# EAGLE design Throttle (EAGLE 7.2.0)
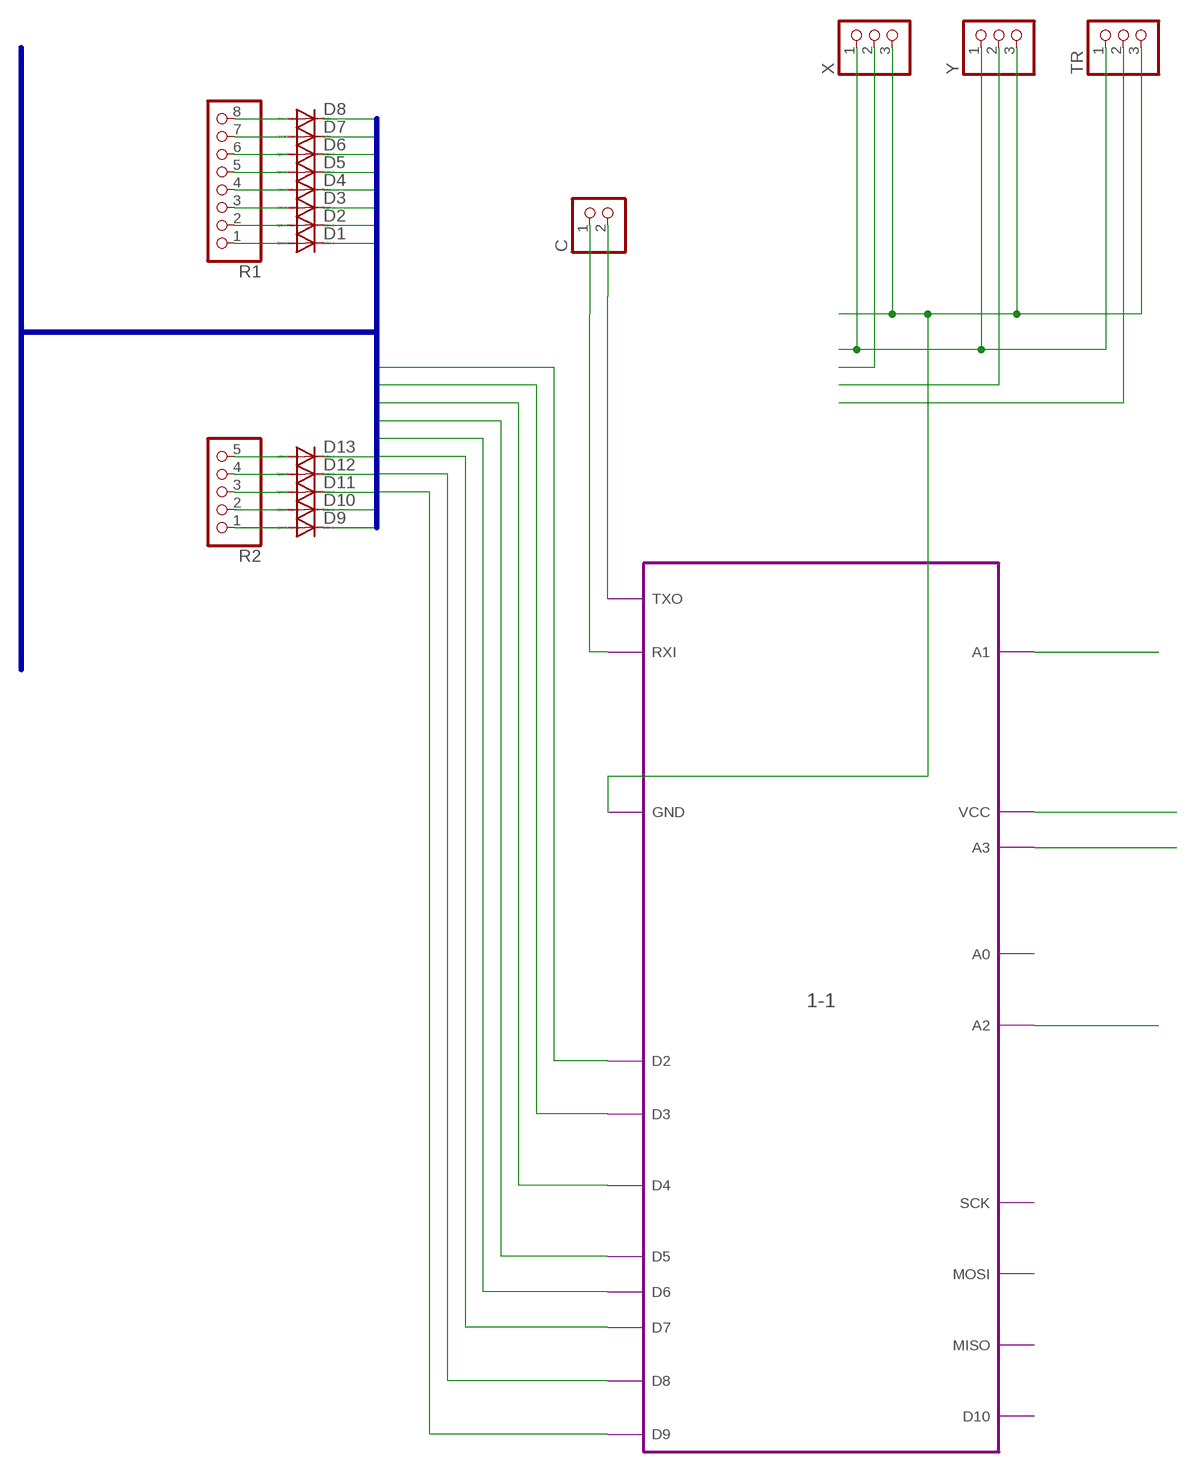
[diagram p0: schematic, sheet 1]

## Parts
C  PINHD-1X2  [1X02]
D1  DIODE-MINIMELF  [MINIMELF]
D2  DIODE-MINIMELF  [MINIMELF]
D3  DIODE-MINIMELF  [MINIMELF]
D4  DIODE-MINIMELF  [MINIMELF]
D5  DIODE-MINIMELF  [MINIMELF]
D6  DIODE-MINIMELF  [MINIMELF]
D7  DIODE-MINIMELF  [MINIMELF]
D8  DIODE-MINIMELF  [MINIMELF]
D9  DIODE-MINIMELF  [MINIMELF]
D10  DIODE-MINIMELF  [MINIMELF]
D11  DIODE-MINIMELF  [MINIMELF]
D12  DIODE-MINIMELF  [MINIMELF]
D13  DIODE-MINIMELF  [MINIMELF]
R1  PINHD-1X8  [1X08]
R2  PINHD-1X5  [1X05]
TR  PINHD-1X3  [1X03]
X  PINHD-1X3  [1X03]
Y  PINHD-1X3  [1X03]

## Module instances
1-1 = 1

## Nets
N$1: C.1 ; port 1-1.RXI
N$2: C.2 ; port 1-1.TXO
N$3: D1.A R1.1
N$4: D2.A R1.2
N$5: D3.A R1.3
N$6: D4.A R1.4
N$7: D5.A R1.5
N$8: D6.A R1.6
N$9: D7.A R1.7
N$10: D8.A R1.8
N$11: D9.A R2.1
N$12: D10.A R2.2
N$13: D11.A R2.3
N$14: D12.A R2.4
N$15: D13.A R2.5
N$16: TR.1 X.1 Y.1 ; port 1-1.VCC
N$19: TR.3 X.3 Y.3 ; port 1-1.GND
N$20: X.2 ; port 1-1.A3
N$21: Y.2 ; port 1-1.A2
N$22: TR.2 ; port 1-1.A1
R1: D1.C D9.C ; port 1-1.D9
R2: D2.C D10.C ; port 1-1.D8
R3: D3.C D11.C ; port 1-1.D7
R4: D4.C D12.C ; port 1-1.D6
R5: D5.C D13.C ; port 1-1.D5
R6: D6.C ; port 1-1.D4
R7: D7.C ; port 1-1.D3
R8: D8.C ; port 1-1.D2

## Buses
R[1..8]

## Library data of the parts
C = pinhead:PINHD-1X2: PIN HEADER
D1-D13 = diode:DIODE-: DIODE
R1 = pinhead:PINHD-1X8: PIN HEADER
R2 = pinhead:PINHD-1X5: PIN HEADER
TR X Y = pinhead:PINHD-1X3: PIN HEADER

## Module 1
Ports: A0(io) D9(io) D8(io) D7(io) D6(io) D5(io) D4(io) D3(io) D2(io) GND(io) A1(io) A2(io) VCC(io) TXO(io) RXI(io) D10(io) MISO(io) MOSI(io) SCK(io) A3(io)
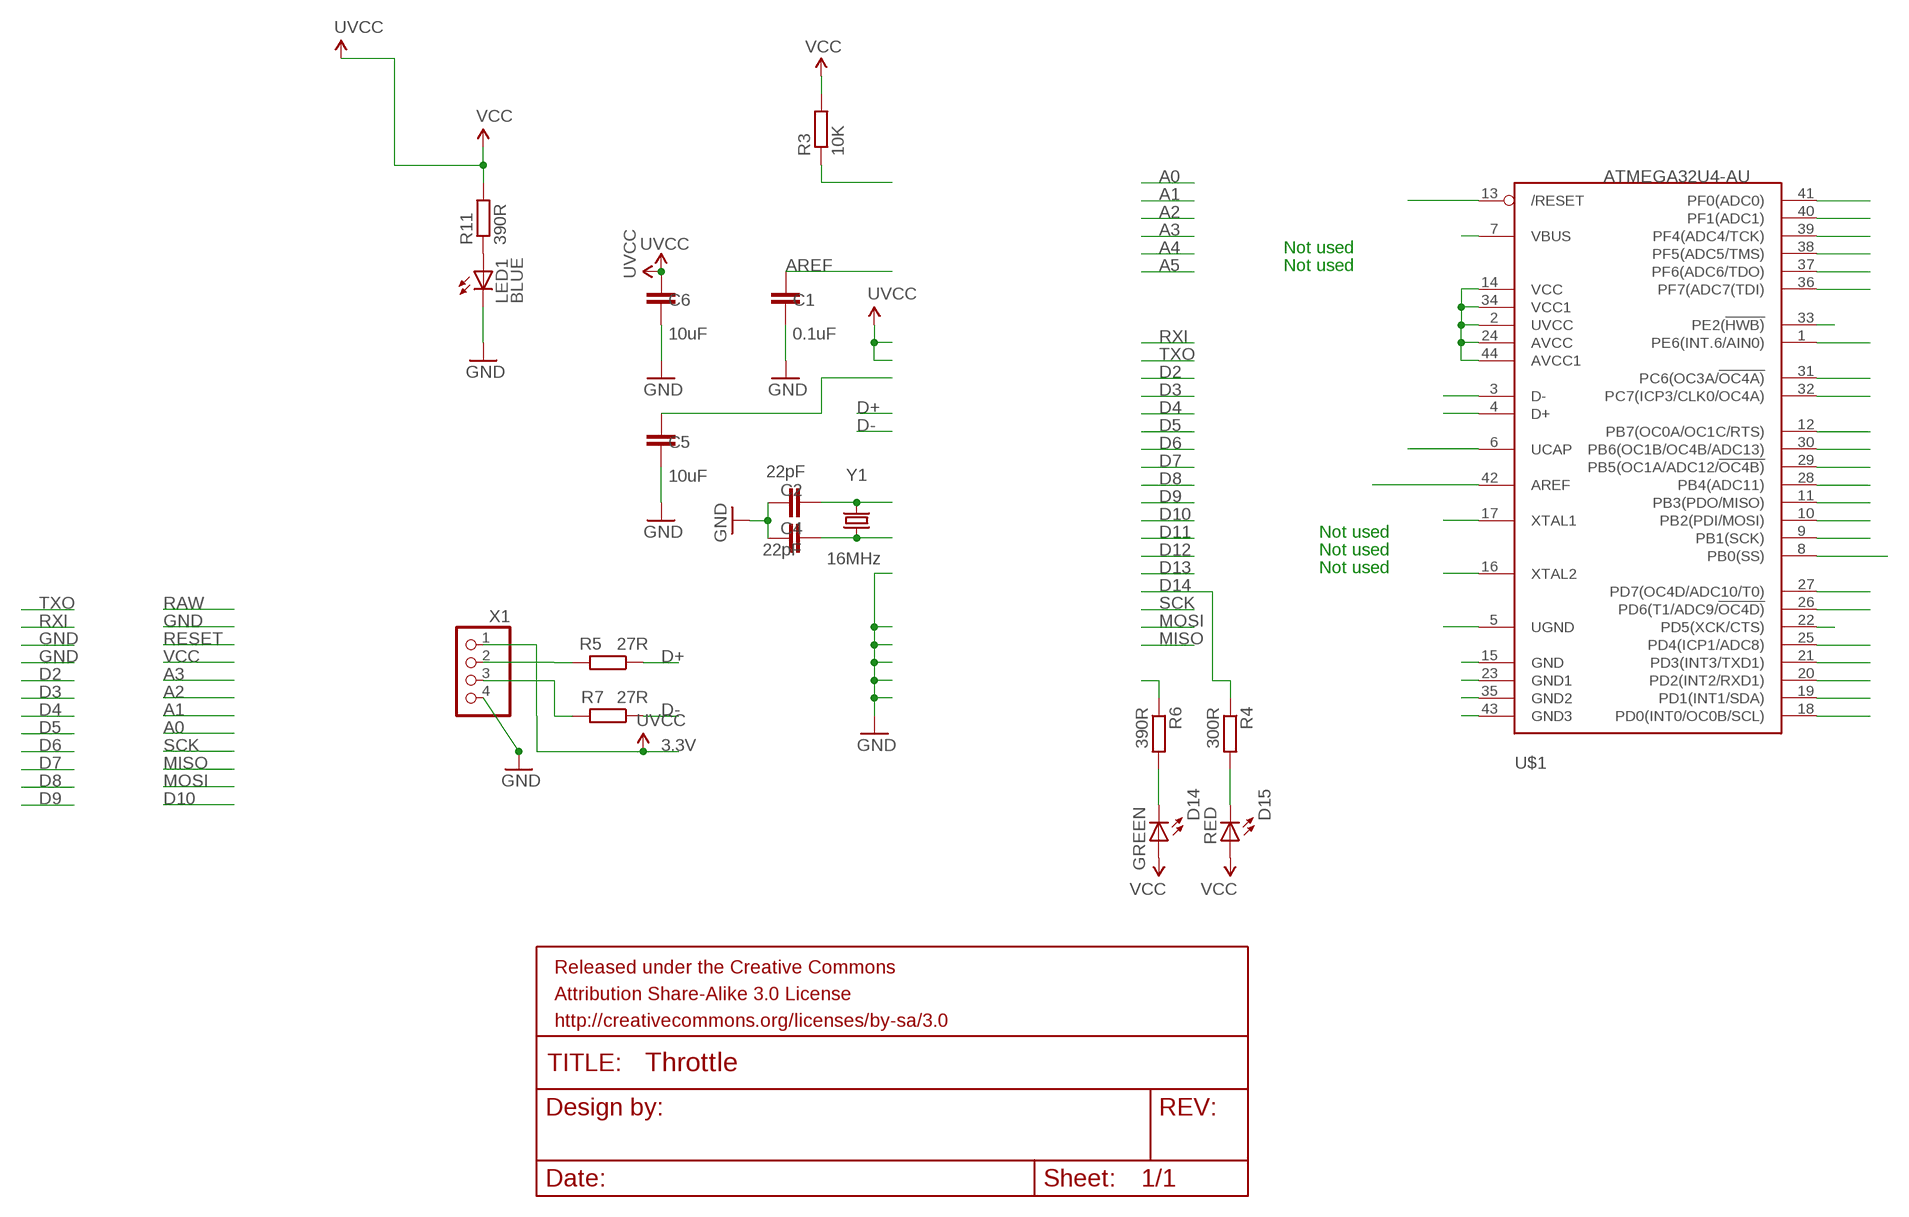
[diagram p1: schematic, module 1, sheet 1]

### Parts
C1  0.1uF  C-EUC1206  [C1206]
C2  22pF  C-EUC1206  [C1206]
C4  22pF  C-EUC1206  [C1206]
C5  10uF  C-EUC1206  [C1206]
C6  10uF  C-EUC1206  [C1206]
D14  GREEN  LED1206  [LED1206]
D15  RED  LED1206  [LED1206]
FRAME1  FRAME-LETTER  [CREATIVE_COMMONS]
LED1  BLUE  LED1206  [LED1206]
R3  10K  R-EU_R1206  [R1206]
R4  300R  R-EU_R1206  [R1206]
R5  27R  R-EU_R1206  [R1206]
R6  390R  R-EU_R1206  [R1206]
R7  27R  R-EU_R1206  [R1206]
R11  390R  R-EU_R1206  [R1206]
U$1  ATMEGA32U4-AU  [TQFP44]
X1  PINHD-1X4  [1X04]
Y1  16MHz  CRYSTALHC49S  [HC49/S]

### Nets
3.3V: C6.2 R11.2 U$1.2(UVCC) U$1.7(VBUS) U$1.14(VCC) U$1.24(AVCC) U$1.34(VCC1) U$1.44(AVCC1) X1.1 ; supply symbol labelled UVCC, VCC
A0: U$1.36(PF7(ADC7(TDI))
A1: U$1.37(PF6(ADC6/TDO))
A2: U$1.38(PF5(ADC5/TMS))
A3: U$1.39(PF4(ADC4/TCK))
A4: U$1.40(PF1(ADC1))
A5: U$1.41(PF0(ADC0))
AREF: C1.2 U$1.42(AREF)
D2: U$1.19(PD1(INT1/SDA))
D3: U$1.18(PD0(INT0/OC0B/SCL))
D4: U$1.25(PD4(ICP1/ADC8))
D5: U$1.31(PC6(OC3A/!OC4A))
D6: U$1.27(PD7(OC4D/ADC10/T0))
D7: U$1.1(PE6(INT.6/AIN0))
D8: U$1.28(PB4(ADC11))
D9: U$1.29(PB5(OC1A/ADC12/!OC4B))
D10: U$1.30(PB6(OC1B/OC4B/ADC13))
D11: U$1.12(PB7(OC0A/OC1C/RTS))
D12: U$1.26(PD6(T1/ADC9/!OC4D))
D13: U$1.32(PC7(ICP3/CLK0/OC4A))
D14: R4.1 U$1.8(PB0(SS))
D+: R5.1 U$1.4(D+)
D-: R7.1 U$1.3(D-)
GND [vcc]: C1.1 C2.2 C4.2 C5.1 C6.1 LED1.C U$1.5(UGND) U$1.15(GND) U$1.23(GND1) U$1.33(PE2(!HWB)) U$1.35(GND2) U$1.43(GND3) X1.4
MISO: U$1.11(PB3(PDO/MISO))
MOSI: U$1.10(PB2(PDI/MOSI))
N$23: C4.1 U$1.16(XTAL2) Y1.1
N$24: C2.1 U$1.17(XTAL1) Y1.2
N$25: C5.2 U$1.6(UCAP)
N$26: R7.2 X1.3
N$27: R5.2 X1.2
N$29: D15.C R4.2
N$30: D14.C R6.2
N$38: LED1.A R11.1
RESET: R3.1 U$1.13(/RESET)
RXI: U$1.20(PD2(INT2/RXD1))
SCK: U$1.9(PB1(SCK))
TXLED: R6.1 U$1.22(PD5(XCK/CTS))
TXO: U$1.21(PD3(INT3/TXD1))
VCC: D14.A D15.A R3.2

### Notes on the sheet
- Not used
- Not used
- Not used
- Not used
- Not used

### Library data of the parts
C1 C2 C4-C6 = rcl:C-EU: CAPACITOR, European symbol
D14 D15 LED1 = Namenlos:LED1206
FRAME1 = SparkFun-Aesthetics:FRAME-LETTER: Schematic Frame Standard 8.5x11 US Letter frame
R3-R7 R11 = rcl:R-EU_: RESISTOR, European symbol
U$1 = Namenlos at:ATMEGA32U4: http://www.ladyada.net/library/eagle
X1 = pinhead:PINHD-1X4: PIN HEADER
Y1 = Namenlos at:CRYSTAL: CRYSTAL; OC_FARNELL: 1667008; OC_NEWARK: unknown

## Net classes
0 default: width 0.203 mm

## Board
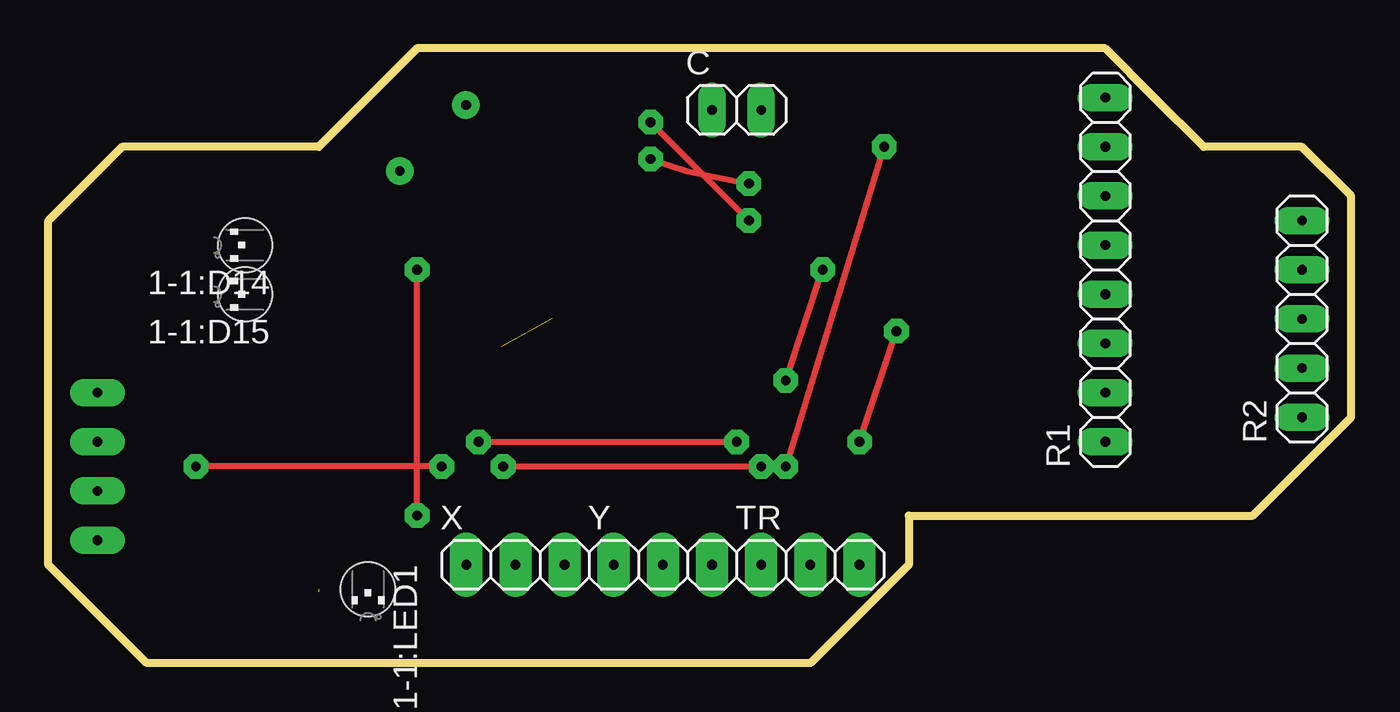
[diagram p2: board, top side]
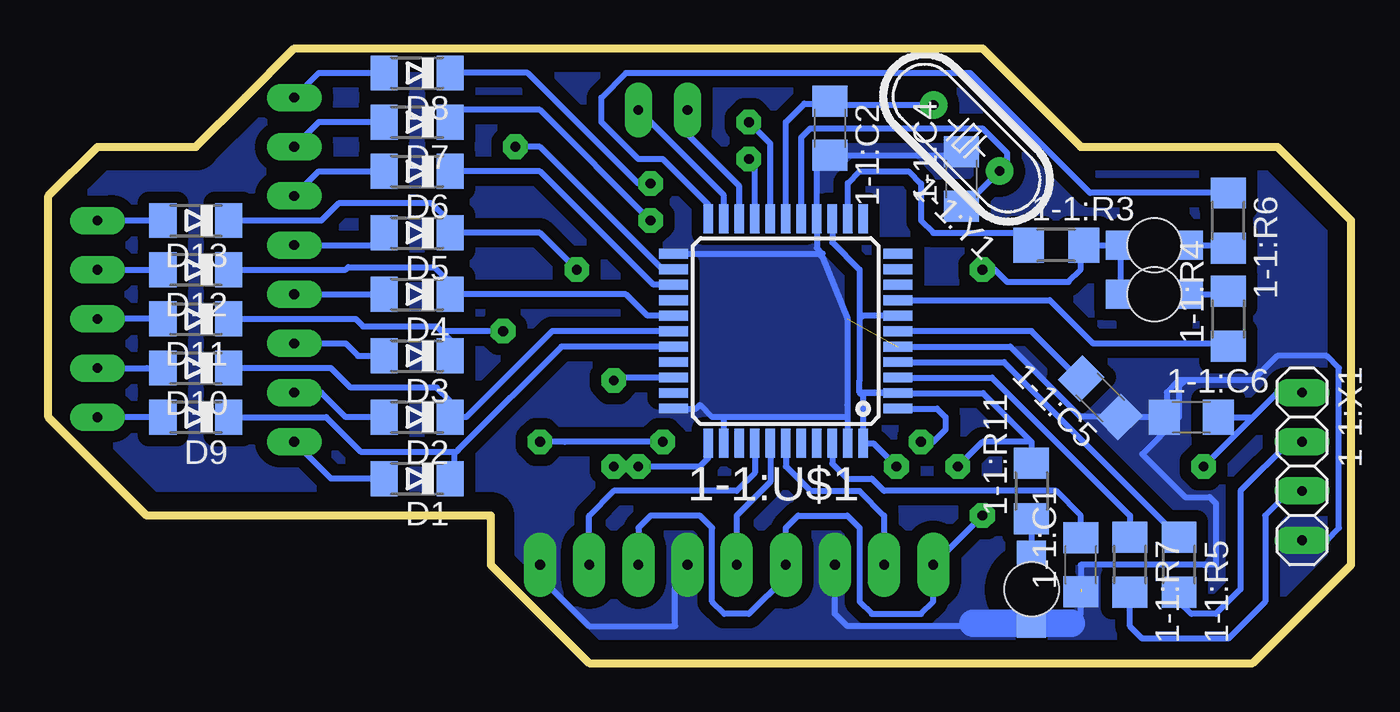
[diagram p3: board, bottom side, seen from below]

Size 67.31 x 31.75 mm. Coordinates in mm from the lower left corner, seen from the top.
Outline: 44.45,7.62 44.45,5.08 39.37,0 5.08,0 0,5.08 0,22.86 3.81,26.67 13.97,26.67 19.05,31.75 54.61,31.75 57.15,29.21 59.69,26.67 64.77,26.67 67.31,24.13 67.31,12.7 62.23,7.62 44.45,7.62
Copper layers (1*16): Top 0.035mm / dielectric 1.5mm / Bottom 0.035mm
Design rules "default *": minimum track width 12mil, minimum drill 24mil, track to track 12mil, track to pad 12mil, pad to pad 12mil, via to via 12mil, smd to smd 12mil, copper to edge 40mil, drill to drill 8mil, minimum pad ring 10mil, minimum via ring 8mil, stop-mask expansion 4mil, vias tented up to drill 0mil, thermal gap 10mil

### Footprints (pad centres in the part's own frame; a part is rotated, then mirrored left to right if it is on the bottom)
C1206 = smd 1.6 x 1.8: 1 -1.4,0; 2 1.4,0
LED1206 = smd 1.5 x 1.5 bottom: A 0,-1.75; C 0,1.75 | hole 2.8: 0,0
R1206 = smd 1.6 x 1.803: 1 -1.422,0; 2 1.422,0
TQFP44 = smd 1.5 x 0.5: 1 -5.8,4; 2 -5.8,3.2; 3 -5.8,2.4; 4 -5.8,1.6; 5 -5.8,0.8; 6 -5.8,0; 7 -5.8,-0.8; 8 -5.8,-1.6; 9 -5.8,-2.4; 10 -5.8,-3.2; 11 -5.8,-4; 23 5.8,-4; 24 5.8,-3.2; 25 5.8,-2.4; 26 5.8,-1.6; 27 5.8,-0.8; 28 5.8,0; 29 5.8,0.8; 30 5.8,1.6; 31 5.8,2.4; 32 5.8,3.2; 33 5.8,4 | smd 0.5 x 1.5: 12 -4,-5.8; 13 -3.2,-5.8; 14 -2.4,-5.8; 15 -1.6,-5.8; 16 -0.8,-5.8; 17 0,-5.8; 18 0.8,-5.8; 19 1.6,-5.8; 20 2.4,-5.8; 21 3.2,-5.8; 22 4,-5.8; 34 4,5.8; 35 3.2,5.8; 36 2.4,5.8; 37 1.6,5.8; 38 0.8,5.8; 39 0,5.8; 40 -0.8,5.8; 41 -1.6,5.8; 42 -2.4,5.8; 43 -3.2,5.8; 44 -4,5.8
1X04 = drill 0.5 pad 1.422 long: 1 -3.81,0; 2 -1.27,0; 3 1.27,0; 4 3.81,0
HC49/S = drill 0.5 pad 1.422: 1 -2.413,0; 2 2.413,0
1X02 = drill 0.5 pad 1.422 long: 1 -1.27,0; 2 1.27,0
MINIMELF = smd 1.4 x 1.8: A 1.7,0; C -1.7,0
1X08 = drill 0.5 pad 1.422 long: 1 -8.89,0; 2 -6.35,0; 3 -3.81,0; 4 -1.27,0; 5 1.27,0; 6 3.81,0; 7 6.35,0; 8 8.89,0
1X05 = drill 0.5 pad 1.422 long: 1 -5.08,0; 2 -2.54,0; 3 0,0; 4 2.54,0; 5 5.08,0
1X03 = drill 0.5 pad 1.676 long: 1 -2.54,0; 2 0,0; 3 2.54,0

### Placement (x,y rotation side)
1-1:C1  0.1uF  [C1206]  13.97,5.08 90 bottom
1-1:C2  22pF  [C1206]  26.93,27.62 270 bottom
1-1:C4  22pF  [C1206]  20.13,25.01 90 bottom
1-1:C5  10uF  [C1206]  12.96,13.71 135 bottom
1-1:C6  10uF  [C1206]  8.26,12.7 0 bottom
1-1:D14  GREEN  [LED1206]  10.16,21.59 90 top
1-1:D15  RED  [LED1206]  10.16,19.05 90 top
1-1:FRAME1  FRAME-LETTER  [CREATIVE_COMMONS]  17.78,35.56 0 top  (outside the outline)
1-1:LED1  BLUE  [LED1206]  16.51,3.81 180 top
1-1:R3  10K  [R1206]  15.24,21.59 0 bottom
1-1:R4  300R  [R1206]  6.35,17.78 90 bottom
1-1:R5  27R  [R1206]  8.89,5.08 270 bottom
1-1:R6  390R  [R1206]  6.35,22.86 270 bottom
1-1:R7  27R  [R1206]  11.43,5.08 270 bottom
1-1:R11  390R  [R1206]  16.51,8.89 90 bottom
1-1:U$1  ATMEGA32U4-AU  [TQFP44]  29.21,17.14 180 bottom
1-1:X1  [1X04]  2.54,10.16 270 bottom
1-1:Y1  16MHz  [HC49/S]  19.87,27.12 135 bottom
C  35.56,28.58 0 top
D1  48.26,9.52 180 bottom
D2  48.26,12.7 180 bottom
D3  48.26,15.88 180 bottom
D4  48.26,19.05 180 bottom
D5  48.26,22.23 180 bottom
D6  48.26,25.4 180 bottom
D7  48.26,27.94 180 bottom
D8  48.26,30.48 180 bottom
D9  59.69,12.7 180 bottom
D10  59.69,15.24 180 bottom
D11  59.69,17.78 180 bottom
D12  59.69,20.32 180 bottom
D13  59.69,22.86 180 bottom
R1  54.61,20.32 90 top
R2  64.77,17.78 90 top
TR  39.37,5.08 0 top
X  24.13,5.08 0 top
Y  31.75,5.08 0 top

### Tracks (layer width: path | path; a pad name or v marks a point on that pad's centre or on a via)
1-1:3.3V  (via drill 0.5 pad 1.27)
  Top 0.305: v20.32,10.16 v7.62,10.16 | v23.5,10.16 v36.83,10.16 | v43.18,26.67 v38.1,10.16
  Bottom 0.305: 1-1:U$1.2 19.03,13.95 16.51,11.43 | 16.51,11.43 1-1:R11.2 | 1-1:U$1.7 24.6,17.95 25.24,17.95 25.4,17.78 | 1-1:U$1.2 23.44,13.97 25.4,13.97 | 16.51,11.43 19.05,11.43 v20.32,10.16 | v7.62,10.16 5.08,12.7 | 5.08,12.7 3.81,13.97 1-1:X1.1 | 1-1:C6.2 5.08,12.7 | 1-1:U$1.14 26.81,21.73 25.4,20.32 25.4,17.78 | 25.4,17.78 25.4,17.14 25.4,14.61 25.4,13.97 | v23.5,10.16 24.68,11.34 1-1:U$1.44 25.21,13.78 25.38,13.95 | 1-1:U$1.34 33.21,10.61 33.66,10.16 v36.83,10.16 v38.1,10.16 | 1-1:U$1.24 35.59,20.34 41.91,26.67 v43.18,26.67 | 1-1:U$1.2 25.38,13.95 | 25.38,13.95 25.4,13.97
1-1:AREF
  Bottom 0.305: 1-1:C1.2 13.97,7.62 15.24,8.89 24.13,8.89 24.77,9.52 26.04,9.52 26.81,10.3 1-1:U$1.42
1-1:D14
  Bottom 0.305: 1-1:U$1.8 15.57,18.75 13.34,16.51 6.5,16.51 1-1:R4.1
1-1:D+
  Bottom 0.305: 1-1:U$1.4 17.93,15.55 1-1:R5.1
1-1:D-
  Bottom 0.305: 1-1:U$1.3 18.56,14.75 11.43,7.62 1-1:R7.1
1-1:N$23
  Bottom 0.305: 1-1:U$1.16 28.41,27.15 27.94,27.62 19.05,27.62 17.78,26.35 17.78,25.8 1-1:Y1.1 19.97,23.6 1-1:C4.1
1-1:N$24
  Bottom 0.305: 1-1:Y1.2 26.74,28.83 1-1:C2.1 27.06,28.89 28.26,28.89 29.21,27.94 1-1:U$1.17
1-1:N$25
  Bottom 0.305: 1-1:C5.2 14.06,14.7 16.51,17.14 1-1:U$1.6
1-1:N$26
  Bottom 0.305: 1-1:X1.3 3.18,8.89 4.45,7.62 4.45,3.18 6.35,1.27 10.8,1.27 11.43,1.91 1-1:R7.2
1-1:N$27
  Bottom 0.305: 1-1:X1.2 3.18,11.43 5.72,8.89 5.72,3.81 6.98,2.54 8.26,2.54 8.89,3.18 1-1:R5.2
1-1:N$29
  Bottom 0.305: 1-1:D15.C 6.5,19.05 1-1:R4.2
1-1:N$30
  Bottom 0.305: 1-1:D14.C 6.5,21.59 1-1:R6.2
1-1:N$38
  Bottom 0.305: 1-1:R11.1 1-1:LED1.A
1-1:RESET
  Bottom 0.305: 1-1:U$1.13 26.01,24.79 25.4,25.4 22.86,25.4 22.23,24.77 22.23,22.86 21.59,22.23 17.3,22.23 1-1:R3.1
1-1:TXLED
  Bottom 0.305: 1-1:R6.1 13.49,24.28 19.05,29.84 19.37,30.16 | 19.37,30.16 19.69,30.48 | 1-1:U$1.22 33.21,23.69 35.56,26.04 36.83,26.04 38.74,27.94 38.74,29.21 37.47,30.48 19.69,30.48 | 19.69,30.48 19.37,30.16
N$1
  Bottom 0.305: 1-1:U$1.20 31.61,24.62 34.29,27.3 C.1
N$2
  Bottom 0.305: 1-1:U$1.21 32.41,24.16 C.2
N$3
  Bottom 0.305: D1.A 52.71,9.52 R1.1
N$4
  Bottom 0.305: D2.A 51.94,12.7 53.21,13.97 R1.2
N$5
  Bottom 0.305: R1.3 51.94,16.51 51.31,15.88 D3.A
N$6
  Bottom 0.305: R1.4 D4.A
N$7
  Bottom 0.305: R1.5 50.6,21.59 D5.A
N$8
  Bottom 0.305: R1.6 53.34,25.4 D6.A
N$9
  Bottom 0.305: D7.A 53.34,27.94 R1.7
N$10
  Bottom 0.305: R1.8 53.34,30.48 D8.A
N$11
  Bottom 0.305: D9.A R2.1
N$12
  Bottom 0.305: R2.2 62.23,15.24 D10.A | D10.A 60.96,15.24 D10.A
N$13
  Bottom 0.305: D11.A R2.3
N$14
  Bottom 0.305: R2.4 D12.A
N$15
  Bottom 0.305: D13.A R2.5
N$16  (via drill 0.5 pad 1.27)
  Top 0.305: v19.05,7.62 v19.05,20.32
  Bottom 0.305: 1-1:D15.A 1-1:D14.A 1-1:R3.2 13.97,21.44 13.97,20.32 14.61,19.68 17.78,19.68 18.42,20.32 v19.05,20.32 | TR.1 36.83,6.98 36.2,7.62 33.66,7.62 33.02,6.98 33.02,3.18 32.39,2.54 31.12,2.54 29.21,4.45 Y.1 29.21,6.98 28.58,7.62 26.04,7.62 25.4,6.98 25.4,3.18 24.77,2.54 22.23,2.54 21.59,3.18 X.1 v19.05,7.62
N$19  (2 unrouted)
  Bottom 0.305: 1-1:U$1.23 27.5,21.15 | 27.5,21.15 27.31,21.15 | 27.31,21.15 27.5,21.15 | 27.5,21.15 27.31,20.95 26.04,17.78 26.04,13.34 26.04,12.7 | 26.04,12.7 32.39,12.7 | 32.39,12.7 33.02,12.7 33.66,13.34 33.85,13.14 1-1:U$1.33 | 1-1:U$1.35 32.41,12.68 32.39,12.7 | 1-1:U$1.43 26.01,12.68 26.04,12.7 | 27.31,21.15 27.61,21.45 1-1:U$1.15 27.61,25.55 1-1:C2.2 20.32,26.22 1-1:C4.2 | 14.45,2.06 13.97,2.54 1-1:C1.1 | 19.53,2.06 19.69,1.91 26.04,1.91 26.67,2.54 X.3 | 1-1:U$1.5 17.62,16.34 13.97,12.7 13.95,12.72 1-1:C5.1 9.67,12.72 1-1:C6.1 9.53,12.83 9.53,13.97 8.89,14.61 5.08,14.61 | 1.27,6.35 1-1:X1.4 1.27,6.35 | 1.27,6.35 0.64,6.98 | 0.64,6.98 0.64,15.24 | 0.64,15.24 1.27,15.88 | 1.27,15.88 3.81,15.88 | 3.81,15.88 5.08,14.61 | 13.97,3.81 13.97,5.08 7.62,5.08 6.98,5.08 6.98,8.25 7.3,8.57 8.57,8.57 10.8,10.8 8.89,12.7 8.89,14.29 8.57,14.61 5.08,14.61 | 1.27,6.35 0.64,6.98 | 0.64,6.98 0.64,15.24 | 0.64,15.24 1.27,15.88 | 1.27,15.88 3.81,15.88 | 3.81,15.88 5.08,14.61 | TR.3 41.91,4.45 39.37,1.91 34.93,1.91 34.93,4.45 Y.3
  Bottom 1.422: 14.45,2.06 1-1:LED1.C 19.53,2.06
  pour Bottom (isolate 0.61, no thermals): 0,5.08 0,22.86 3.81,26.67 13.97,26.67 19.05,31.75 54.61,31.75 59.69,26.67 64.77,26.67 67.31,24.13 67.31,12.7 62.23,7.62 44.45,7.62 44.45,5.08 39.37,0 5.08,0
N$20
  Bottom 0.305: 1-1:U$1.39 29.21,10.16 27.94,8.89 25.4,8.89 24.13,7.62 X.2
N$21
  Bottom 0.305: 1-1:U$1.38 30.01,9.36 31.75,7.62 Y.2
N$22
  Bottom 0.305: TR.2 39.37,7.62 38.1,8.89 31.75,8.89 30.81,9.83 1-1:U$1.37
R1
  Bottom 0.305: 1-1:U$1.29 40.81,16.34 45.97,11.18 | 45.97,11.18 46.36,10.8 46.36,9.73 D1.C | D9.C 52.96,12.7 51.18,10.92 46.23,10.92 45.97,11.18
R2
  Bottom 0.305: 1-1:U$1.28 41.28,17.14 45.72,12.7 D2.C 46.56,13.54 47.24,14.22 51.69,14.22 52.71,15.24 D10.C
R3  (via drill 0.5 pad 1.27)
  Top 0.305: v22.23,11.43 v35.56,11.43 | v41.91,11.43 v43.82,17.14
  Bottom 0.305: D3.C 46.56,16.71 46.99,17.14 | 46.99,17.14 47.24,17.4 51.05,17.4 51.44,17.78 D11.C | 1-1:U$1.1 21.4,13.14 20.96,12.7 20.96,12.07 21.59,11.43 v22.23,11.43 | v35.56,11.43 40.64,11.43 v41.91,11.43 | v43.82,17.14 46.99,17.14
R4
  Bottom 0.305: 1-1:U$1.27 36.36,17.95 37.47,19.05 D4.C 46.48,19.13 46.48,19.56 47.37,20.45 51.82,20.45 51.94,20.32 D12.C
R5  (via drill 0.5 pad 1.27)
  Top 0.305: v38.1,14.61 v40.01,20.32
  Bottom 0.305: 1-1:U$1.31 38.24,14.75 v38.1,14.61 | v40.01,20.32 41.91,22.23 D5.C 46.56,22.81 47.5,23.75 52.32,23.75 53.21,22.86 D13.C
R6
  Bottom 0.305: 1-1:U$1.25 36.06,19.55 41.91,25.4 D6.C
R7  (via drill 0.5 pad 1.27)
  Top 0.305: v31.12,27.94 v36.2,22.86
  Bottom 0.305: 1-1:U$1.18 30.01,26.84 v31.12,27.94 | 45.93,28.58 46.14,28.36 | 46.14,28.36 D7.C | v36.2,22.86 41.91,28.58 45.93,28.58 | 45.93,28.58 46.14,28.36
R8  (via drill 0.5 pad 1.27)
  Top 0.305: v31.12,26.04 33.02,25.4 v36.2,24.77
  Bottom 0.305: 1-1:U$1.19 30.81,25.73 v31.12,26.04 | v36.2,24.77 36.83,24.77 42.55,30.48 D8.C